# Altium schematic sheet Capstone V2.SchDoc
size B
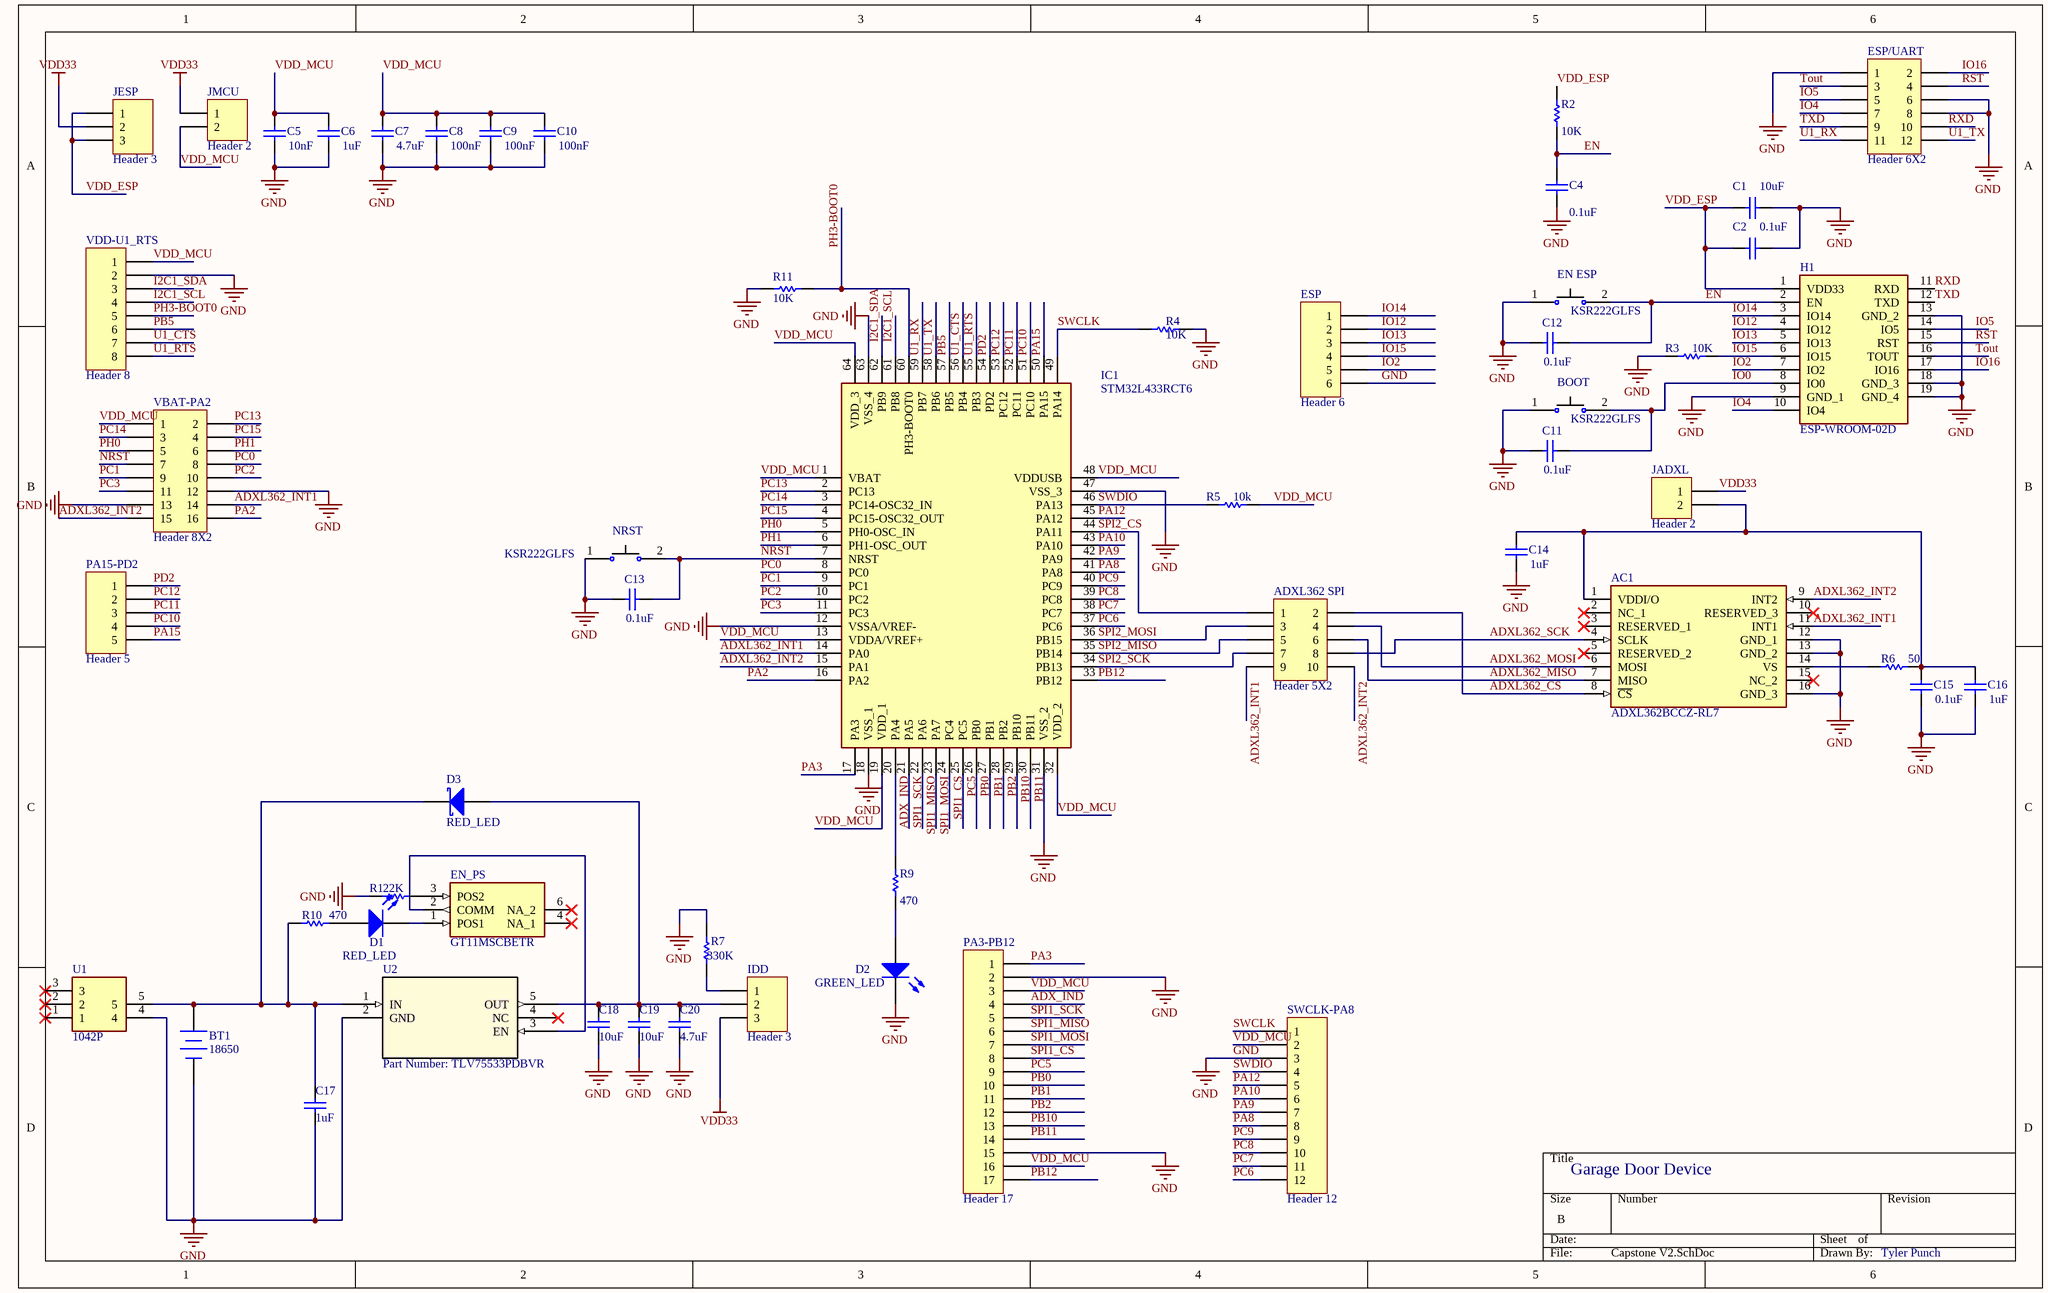
[diagram p0: Capstone V2.SchDoc]

## Parts
AC1  ADXL362BCCZ-RL7  [CC-16-4]
ADXL362_SPI  Header 5X2  [HDR2X5]
BOOT  KSR222GLFS  [*SW_KSR223GLFG]
BT1  18650  [BAT-2]
C1  value 10uF  [*CAPC2012X88N]  (hidden comment: Cap)
C2  value 0.1uF  [*CAPC2012X88N]  (hidden comment: Cap)
C4  value 0.1uF  [*CAPC2012X88N]  (hidden comment: Cap)
C5  value 10nF  [*CAPC2012X88N]  (hidden comment: Cap)
C6  value 1uF  [*CAPC2012X88N]  (hidden comment: Cap)
C7  value 4.7uF  [*CAPC2012X88N]  (hidden comment: Cap)
C8  value 100nF  [*CAPC2012X88N]  (hidden comment: Cap)
C9  value 100nF  [*CAPC2012X88N]  (hidden comment: Cap)
C10  value 100nF  [*CAPC2012X88N]  (hidden comment: Cap)
C11  value 0.1uF  [*CAPC2012X88N]  (hidden comment: Cap)
C12  value 0.1uF  [*CAPC2012X88N]  (hidden comment: Cap)
C13  value 0.1uF  [*CAPC2012X88N]  (hidden comment: Cap)
C14  value 1uF  [*CAPC2012X88N]  (hidden comment: Cap)
C15  value 0.1uF  [*CAPC2012X88N]  (hidden comment: Cap)
C16  value 1uF  [*CAPC2012X88N]  (hidden comment: Cap)
C17  value 1uF  [*CAPC2012X88N]  (hidden comment: Cap)
C18  value 10uF  [6-0805_M]  (hidden comment: Cap)
C19  value 10uF  [6-0805_M]  (hidden comment: Cap)
C20  value 4.7uF  [6-0805_M]  (hidden comment: Cap)
D1  RED_LED  [6-0805_M]
D2  GREEN_LED  [6-0805_M]
D3  RED_LED  [SD0805]
EN_ESP  KSR222GLFS  [*SW_KSR223GLFG]
EN_PS  GT11MSCBETR  [GT11MSCBE]
ESP  Header 6  [HDR1X6]
ESP/UART  Header 6X2  [HDR2X6]
H1  ESP-WROOM-02D  [ESPWROOM02D]
IC1  STM32L433RCT6  [QFP50P1200X1200X160-64N]
IDD  Header 3  [HDR1X3]
JADXL  Header 2  [HDR1X2]
JESP  Header 3  [HDR1X3]
JMCU  Header 2  [HDR1X2]
NRST  KSR222GLFS  [*SW_KSR223GLFG]
PA3-PB12  Header 17  [HDR1X17]
PA15-PD2  Header 5  [HDR1X5]
R1  value 22K  [6-0805_M]  (hidden comment: Res1)
R2  value 10K  [6-0805_M]  (hidden comment: Res1)
R3  value 10K  [6-0805_M]  (hidden comment: Res1)
R4  value 10K  [6-0805_M]  (hidden comment: Res1)
R5  value 10k  [6-0805_M]  (hidden comment: Res1)
R6  value 50  [6-0805_M]  (hidden comment: Res1)
R7  value 330K  [6-0805_M]  (hidden comment: Res1)
R9  value 470  [6-0805_M]  (hidden comment: Res1)
R10  value 470  [6-0805_M]  (hidden comment: Res1)
R11  value 10K  [6-0805_N]  (hidden comment: Res1)
SWCLK-PA8  Header 12  [HDR1X12]
U1  1042P  [1042P]
U2  Part Number: TLV75533PDBVR  [DBV5]
VBAT-PA2  Header 8X2  [HDR2X8]
VDD-U1_RTS  Header 8  [HDR1X8]

## Nets
GND: AC1.12(GND_1) AC1.13(GND_2) AC1.16(GND_3) BOOT.1 BT1.2(-) C1.2 C2.2 C4.2 C5.1 C6.1 C7.1 C8.1 C9.1 C10.1 C11.1 C12.1 C13.1 C14.2 C15.1 C16.2 C17.1 C18.1 C19.1 C20.1 D2.2(K) EN_ESP.1 ESP.6 ESP/UART.1 ESP/UART.6 ESP/UART.8 H1.9(GND_1) H1.13(GND_2) H1.18(GND_3) H1.19(GND_4) IC1.12(VSSA/VREF-) IC1.18(VSS_1) IC1.31(VSS_2) IC1.47(VSS_3) IC1.63(VSS_4) NRST.1 PA3-PB12.2 PA3-PB12.15 R1.1 R3.1 R4.2 R7.2 R11.2 SWCLK-PA8.3 U1.4 U2.2(GND) VBAT-PA2.12 VBAT-PA2.13 VDD-U1_RTS.2
VDD33: IDD.3 JADXL.1 JESP.2 JMCU.1
ADX_IND: IC1.20(PA4) PA3-PB12.4 R9.2
ADXL362_CS: AC1.8(~{CS}) ADXL362_SPI.2
ADXL362_INT1: AC1.11(INT1) ADXL362_SPI.9 IC1.14(PA0) VBAT-PA2.14
ADXL362_INT2: AC1.9(INT2) ADXL362_SPI.10 IC1.15(PA1) VBAT-PA2.15
ADXL362_MISO: AC1.7(MISO) ADXL362_SPI.6
ADXL362_MOSI: AC1.6(MOSI) ADXL362_SPI.4
ADXL362_SCK: AC1.4(SCLK) ADXL362_SPI.8
EN: C4.1 C12.2 EN_ESP.2 H1.2(EN) R2.2
I2C1_SCL: IC1.61(PB8) VDD-U1_RTS.4
I2C1_SDA: IC1.62(PB9) VDD-U1_RTS.3
IO0: BOOT.2 C11.2 H1.8(IO0)
IO2: ESP.5 H1.7(IO2)
IO4: ESP/UART.7 H1.10(IO4)
IO5: ESP/UART.5 H1.14(IO5)
IO12: ESP.2 H1.4(IO12)
IO13: ESP.3 H1.5(IO13)
IO14: ESP.1 H1.3(IO14)
IO15: ESP.4 H1.6(IO15) R3.2
IO16: ESP/UART.2 H1.17(IO16)
NRST: C13.2 IC1.7(NRST) NRST.2 VBAT-PA2.7
PA2: IC1.16(PA2) VBAT-PA2.16
PA3: IC1.17(PA3) PA3-PB12.1
PA8: IC1.41(PA8) SWCLK-PA8.8
PA9: IC1.42(PA9) SWCLK-PA8.7
PA10: IC1.43(PA10) SWCLK-PA8.6
PA12: IC1.45(PA12) SWCLK-PA8.5
PA15: IC1.50(PA15) PA15-PD2.5
PB0: IC1.26(PB0) PA3-PB12.10
PB1: IC1.27(PB1) PA3-PB12.11
PB2: IC1.28(PB2) PA3-PB12.12
PB5: IC1.57(PB5) VDD-U1_RTS.6
PB10: IC1.29(PB10) PA3-PB12.13
PB11: IC1.30(PB11) PA3-PB12.14
PB12: IC1.33(PB12) PA3-PB12.17
PC0: IC1.8(PC0) VBAT-PA2.8
PC1: IC1.9(PC1) VBAT-PA2.9
PC2: IC1.10(PC2) VBAT-PA2.10
PC3: IC1.11(PC3) VBAT-PA2.11
PC5: IC1.25(PC5) PA3-PB12.9
PC6: IC1.37(PC6) SWCLK-PA8.12
PC7: IC1.38(PC7) SWCLK-PA8.11
PC8: IC1.39(PC8) SWCLK-PA8.10
PC9: IC1.40(PC9) SWCLK-PA8.9
PC10: IC1.51(PC10) PA15-PD2.4
PC11: IC1.52(PC11) PA15-PD2.3
PC12: IC1.53(PC12) PA15-PD2.2
PC13: IC1.2(PC13) VBAT-PA2.2
PC14: IC1.3(PC14-OSC32_IN) VBAT-PA2.3
PC15: IC1.4(PC15-OSC32_OUT) VBAT-PA2.4
PD2: IC1.54(PD2) PA15-PD2.1
PH0: IC1.5(PH0-OSC_IN) VBAT-PA2.5
PH1: IC1.6(PH1-OSC_OUT) VBAT-PA2.6
PH3-BOOT0: IC1.60(PH3-BOOT0) R11.1 VDD-U1_RTS.5
RST: ESP/UART.4 H1.15(RST)
RXD: ESP/UART.10 H1.11(RXD)
SPI1_CS: IC1.24(PC4) PA3-PB12.8
SPI1_MISO: IC1.22(PA6) PA3-PB12.6
SPI1_MOSI: IC1.23(PA7) PA3-PB12.7
SPI1_SCK: IC1.21(PA5) PA3-PB12.5
SPI2_CS: ADXL362_SPI.1 IC1.44(PA11)
SPI2_MISO: ADXL362_SPI.5 IC1.35(PB14)
SPI2_MOSI: ADXL362_SPI.3 IC1.36(PB15)
SPI2_SCK: ADXL362_SPI.7 IC1.34(PB13)
SWCLK: IC1.49(PA14) R4.1 SWCLK-PA8.1
SWDIO: IC1.46(PA13) R5.1 SWCLK-PA8.4
Tout: ESP/UART.3 H1.16(TOUT)
TXD: ESP/UART.9 H1.12(TXD)
U1_CTS: IC1.56(PB4) VDD-U1_RTS.7
U1_RTS: IC1.55(PB3) VDD-U1_RTS.8
U1_RX: ESP/UART.11 IC1.59(PB7)
U1_TX: ESP/UART.12 IC1.58(PB6)
VDD_ESP: C1.1 C2.1 H1.1(VDD33) JESP.1 JESP.3 R2.1
VDD_MCU: C5.2 C6.2 C7.2 C8.2 C9.2 C10.2 IC1.1(VBAT) IC1.13(VDDA/VREF+) IC1.19(VDD_1) IC1.32(VDD_2) IC1.48(VDDUSB) IC1.64(VDD_3) JMCU.2 PA3-PB12.3 PA3-PB12.16 R5.2 SWCLK-PA8.2 VBAT-PA2.1 VDD-U1_RTS.1
NetAC1_1: AC1.1(VDDI/O) C14.1 C15.2 C16.1 JADXL.2 R6.2
NetAC1_14: AC1.14(VS) R6.1
NetBT1_1: BT1.1(+) C17.2 D3.2(K) R10.1 U1.5 U2.1(IN)
NetC18_2: C18.2 C19.2 C20.2 D3.1(A) IDD.2 U2.5(OUT)
NetD1_1: D1.1(A) R10.2
NetD1_2: D1.2(K) EN_PS.1(POS1)
NetD2_1: D2.1(A) R9.1
NetEN_PS_2: EN_PS.2(COMM) U2.3(EN)
NetEN_PS_3: EN_PS.3(POS2) R1.2
NetIDD_1: IDD.1 R7.1

Not connected (* = marked no-connect by the designer): AC1 2(NC_1)* 3(RESERVED_1)* 5(RESERVED_2)* 10(RESERVED_3)* 15(NC_2)*; EN_PS 4(NA_1)* 6(NA_2)*; U1 1* 2* 3*; U2 4(NC)*

## Notes on the sheet
- Garage Door Device
- Tyler Punch

## Library data of the parts
AC1 = ADXL362BCCZ-RL7: Accelerometer; Manufacturer_Name: Analog Devices; Datasheet Link: http://www.analog.com/media/en/technical-documentation/data-sheets/ADXL362.pdf; Manufacturer_Part_Number: ADXL362BCCZ-RL7; Mouser Part Number: 584-ADXL362BCCZ-R7; Mouser Price/Stock: https://www.mouser.com/Search/Refine.aspx?Keyword=584-ADXL362BCCZ-R7
ADXL362_SPI = Header 5X2: Header, 5-Pin, Dual row; LatestRevisionDate: 17-Jul-2002; LatestRevisionNote: Re-released for DXP Platform.; Publisher: Altium Limited
BOOT EN_ESP NRST = KSR223GLFG: Switch Tactile N.O. SPST Round Button Gull Wing 0.01A 32VDC 0.2VA 200000Cycles 2N SMD Automotive T/R; MF: C&K; Package: None; Digi-Key_Purchase_URL: https://www.digikey.com/product-detail/en/c-k/KSR223GLFG/401-1704-1-ND/958078?utm_source=snapeda&utm_medium=aggregator&utm_campaign=symbol; SnapEDA_Link: https://www.snapeda.com/parts/KSR223GLFG/C%26K/view-part/?ref=snap; MP: KSR223GLFG; Digi-Key_Part_Number: 401-1704-1-ND; Value: *
BT1 = Battery: Multicell Battery; Published: 24-Mar-1999; LatestRevisionDate: 17-Jul-2002; LatestRevisionNote: Re-released for DXP Platform.; PackageReference: BAT-2; Publisher: Altium Limited; PackageDescription: Battery; 2 Leads
C1 C2 C4-C20 = Cap: Capacitor; Published: 8-Jun-2000; LatestRevisionDate: 17-Jul-2002; LatestRevisionNote: Re-released for DXP Platform.; PackageReference: RAD-0.3; Publisher: Altium Limited; PackageDescription: Radial Cap, Thru-Hole; 2 Leads; 0.3 in Pin Spacing
D1 D2 = LED3: Typical BLUE SiC LED; Published: 8-Jun-2000; LatestRevisionDate: 17-Dec-2003; LatestRevisionNote: PCB Footprint replaced.; DatasheetVersion: 16-Apr-2002; PackageVersion: 16-Apr-2002; PackageReference: 3.5X2.8X1.9; Publisher: Altium Limited; PackageDescription: SM LED; 2 C-Bend Leads; Body 3.5 x 2.8 x 1.9 mm, inc leads (LxWxH typ)
D3 = D Schottky: Schottky Diode; Published: 8-Jun-2000; LatestRevisionDate: 17-Jul-2002; LatestRevisionNote: Re-released for DXP Platform.; PackageReference: SMB; Publisher: Altium Limited; PackageDescription: DO-214-AA/SMB; 2 C-Bend Leads; Body 5.3 x 3.6 mm, inc. leads (LxW); Code_JEDEC: DO-214-AA
EN_PS = GT11MSCBETR: Switch; Manufacturer_Name: C & K COMPONENTS; Datasheet Link: https://componentsearchengine.com/Datasheets/1/GT11MSCBETR.pdf; Manufacturer_Part_Number: GT11MSCBETR; Mouser Part Number: 611-GT11MSCBETR; Mouser Price/Stock: https://www.mouser.com/Search/Refine.aspx?Keyword=611-GT11MSCBETR
ESP = Header 6: Header, 6-Pin; LatestRevisionDate: 17-Jul-2002; LatestRevisionNote: Re-released for DXP Platform.; Publisher: Altium Limited
ESP/UART = Header 6X2: Header, 6-Pin, Dual row; LatestRevisionDate: 17-Jul-2002; LatestRevisionNote: Re-released for DXP Platform.; Publisher: Altium Limited
H1 = ESP-WROOM-02D: Hardware; Manufacturer_Name: Espressif; Datasheet Link: https://br.mouser.com/datasheet/2/891/esp-wroom-02d_esp-wroom-02u_datasheet_en-1365835.pdf; Height: 3.2mm; Manufacturer_Part_Number: ESP-WROOM-02D; Mouser Part Number: 356-ESPWROOM-02D
IC1 = STM32L433RCT6: Integrated Circuit; Manufacturer_Name: STMicroelectronics; Datasheet Link: https://www.st.com/resource/en/datasheet/stm32l433rc.pdf; Height: 1.6mm; Manufacturer_Part_Number: STM32L433RCT6; Mouser Part Number: 511-STM32L433RCT6; Mouser Price/Stock: https://www.mouser.com/Search/Refine.aspx?Keyword=511-STM32L433RCT6
IDD JESP = Header 3: Header, 3-Pin; LatestRevisionDate: 17-Jul-2002; LatestRevisionNote: Re-released for DXP Platform.; Publisher: Altium Limited
JADXL JMCU = Header 2: Header, 2-Pin; LatestRevisionDate: 17-Jul-2002; LatestRevisionNote: Re-released for DXP Platform.; Publisher: Altium Limited
PA3-PB12 = Header 17: Header, 17-Pin; LatestRevisionDate: 17-Jul-2002; LatestRevisionNote: Re-released for DXP Platform.; Publisher: Altium Limited
PA15-PD2 = Header 5: Header, 5-Pin; LatestRevisionDate: 17-Jul-2002; LatestRevisionNote: Re-released for DXP Platform.; Publisher: Altium Limited
R1-R7 R9-R11 = Res1: Resistor; Published: 8-Jun-2000; LatestRevisionDate: 17-Jul-2002; LatestRevisionNote: Re-released for DXP Platform.; PackageReference: AXIAL-0.3; Publisher: Altium Limited; PackageDescription: Axial Device, Thru-Hole; 2 Leads; 0.3 in Pin Spacing
SWCLK-PA8 = Header 12: Header, 12-Pin; LatestRevisionDate: 17-Jul-2002; LatestRevisionNote: Re-released for DXP Platform.; Publisher: Altium Limited
U1 = 1042P: Undefined or Miscellaneous; Manufacturer_Name: Keystone Electronics; Allied_Number: 71135189; Datasheet Link: http://www.keyelco.com/product-pdf.cfm?p=13957; Height: 14mm; Manufacturer_Part_Number: 1042P; Mouser Part Number: 534-1042P; Mouser Price/Stock: https://www.mouser.com/Search/Refine.aspx?Keyword=534-1042P; Allied Price/Stock: https://www.alliedelec.com/keystone-electronics-1042p/71135189/
U2 = TLV75533PDBVR: No Description Available; Vendor: Texas Instruments; Manufacturer_Part_Number: TLV75533PDBVR; Copyright: Copyright (C) 2018 Accelerated Designs. All rights reserved; RefDes: RefDes; Type: DEV; Value: Value
VBAT-PA2 = Header 8X2: Header, 8-Pin, Dual row; LatestRevisionDate: 17-Jul-2002; LatestRevisionNote: Re-released for DXP Platform.; Publisher: Altium Limited
VDD-U1_RTS = Header 8: Header, 8-Pin; LatestRevisionDate: 17-Jul-2002; LatestRevisionNote: Re-released for DXP Platform.; Publisher: Altium Limited